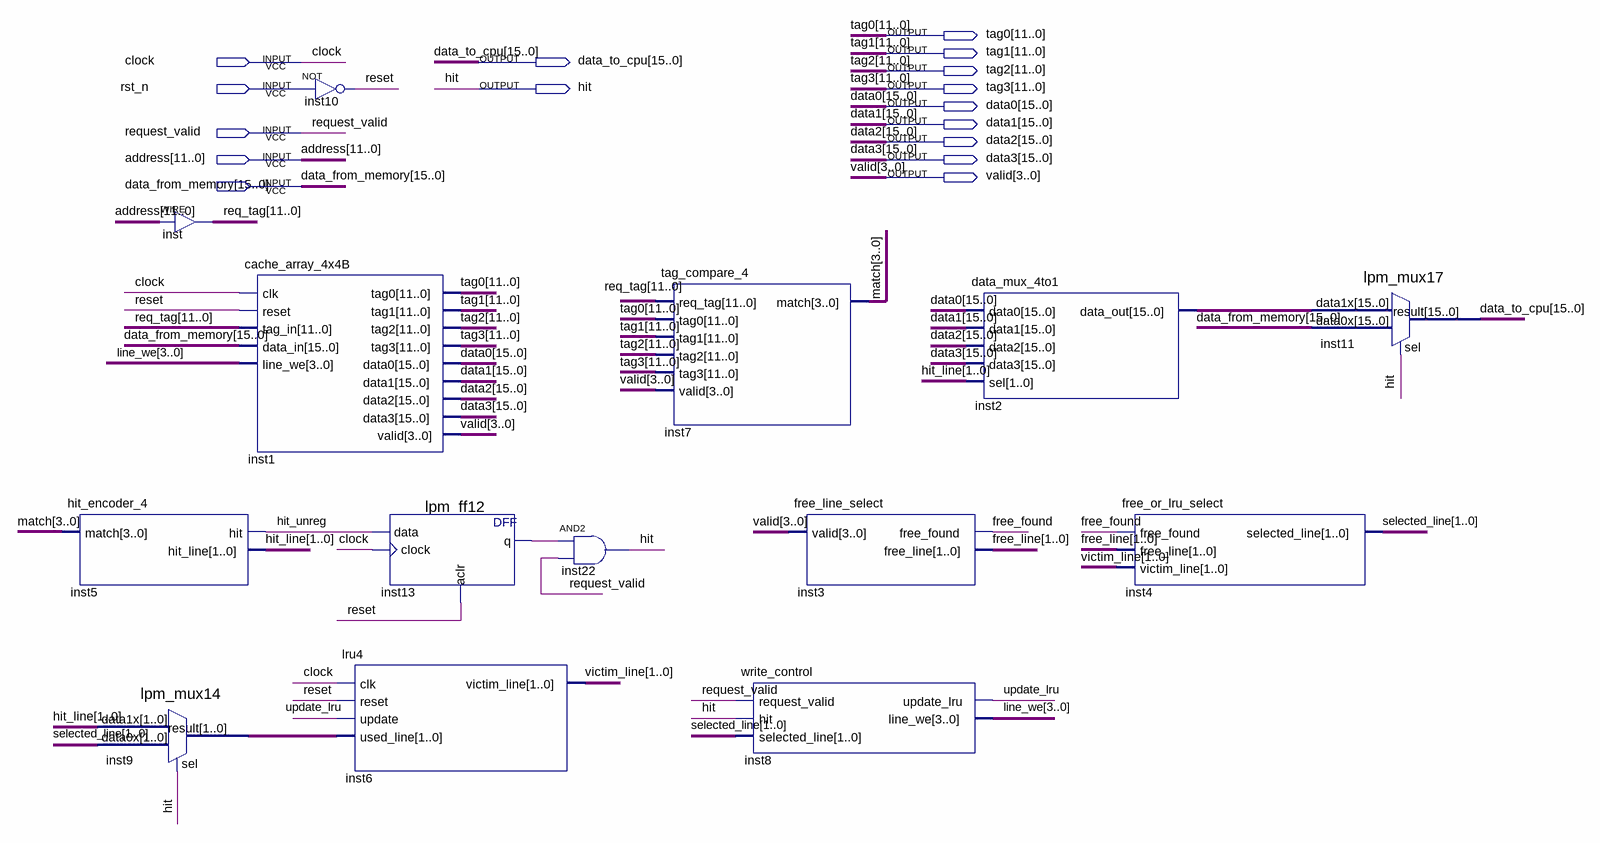
[diagram p0: schematic sheet]
// Quartus schematic cache_lru.bdf as structural Verilog: 14 symbols, 16 pins
module cache_lru (
  input  clock,
  input  rst_n,
  input  request_valid,
  input  [11:0] address,
  input  [15:0] data_from_memory,
  output [11:0] tag0,
  output [11:0] tag1,
  output [15:0] data_to_cpu,
  output [11:0] tag2,
  output hit,
  output [11:0] tag3,
  output [15:0] data0,
  output [15:0] data1,
  output [15:0] data2,
  output [15:0] data3,
  output [3:0] valid
);

  wire free_found, hit_unreg, inst13_q, reset, update_lru;
  wire [1:0] free_line, hit_line, inst9_result, selected_line, victim_line;
  wire [3:0] line_we, match;
  wire [11:0] req_tag;
  wire [15:0] inst2_data_out;

  hit_encoder_4 inst5 (.match(match), .hit(hit_unreg), .hit_line(hit_line));
  lpm_mux14 inst9 (.data1x(hit_line), .data0x(selected_line), .sel(hit), .result(inst9_result));
  assign req_tag = address;  // WIRE inst
  cache_array_4x4B inst1 (
    .clk(clock), .reset(reset), .tag_in(req_tag), .data_in(data_from_memory), .line_we(line_we), .tag0(tag0),
    .tag1(tag1), .tag2(tag2), .tag3(tag3), .data0(data0), .data1(data1), .data2(data2), .data3(data3),
    .valid(valid));
  not inst10 (reset, rst_n);
  lru4 inst6 (.clk(clock), .reset(reset), .update(update_lru), .used_line(inst9_result), .victim_line(victim_line));
  lpm_ff12 inst13 (.data(hit_unreg), .clock(clock), .aclr(reset), .q(inst13_q));
  and inst22 (hit, inst13_q, request_valid);
  tag_compare_4 inst7 (
    .req_tag(req_tag), .tag0(tag0), .tag1(tag1), .tag2(tag2), .tag3(tag3), .valid(valid), .match(match));
  write_control inst8 (
    .request_valid(request_valid), .hit(hit), .selected_line(selected_line), .update_lru(update_lru),
    .line_we(line_we));
  free_line_select inst3 (.valid(valid), .free_found(free_found), .free_line(free_line));
  data_mux_4to1 inst2 (
    .data0(data0), .data1(data1), .data2(data2), .data3(data3), .sel(hit_line), .data_out(inst2_data_out));
  free_or_lru_select inst4 (
    .free_found(free_found), .free_line(free_line), .victim_line(victim_line), .selected_line(selected_line));
  lpm_mux17 inst11 (.data1x(inst2_data_out), .data0x(data_from_memory), .sel(hit), .result(data_to_cpu));
endmodule
